# EAGLE board D-DAQ (EAGLE 6.4), part 1 of 2
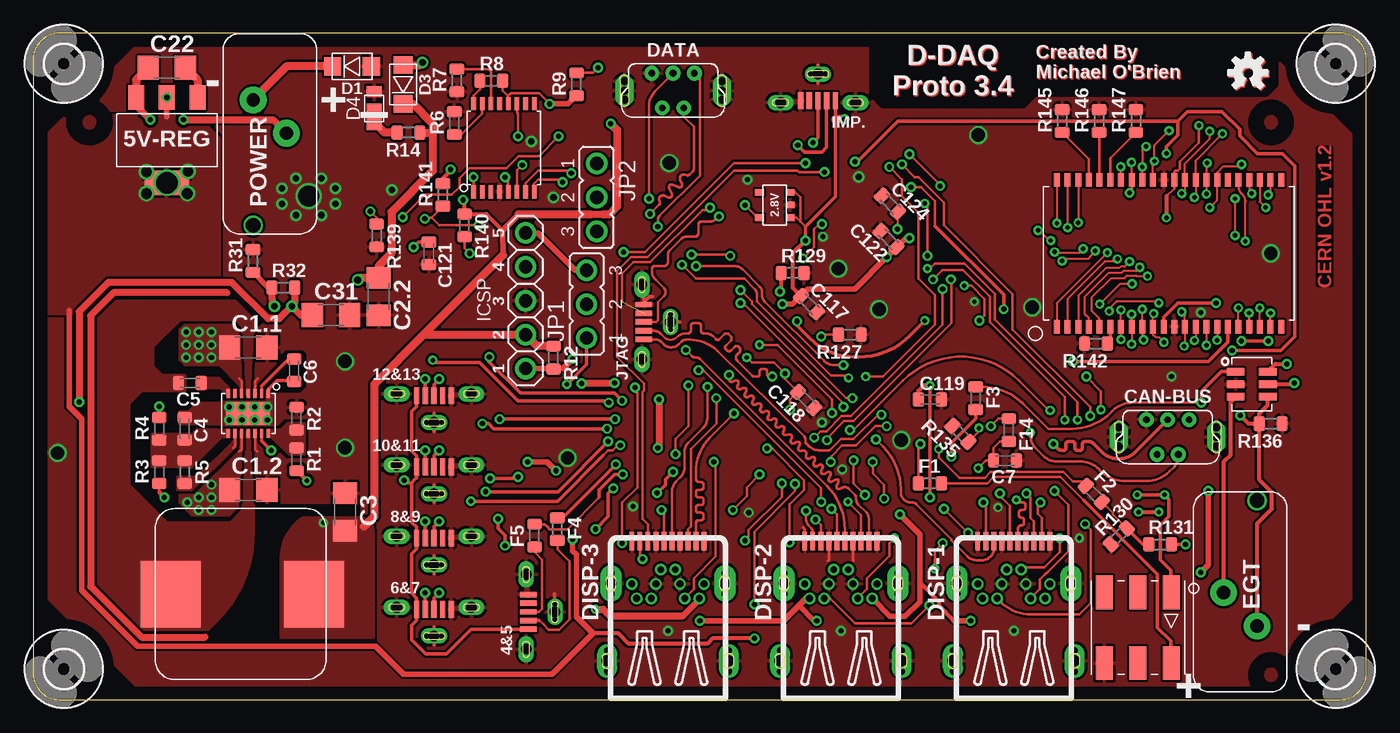
[diagram p1: board, top side]
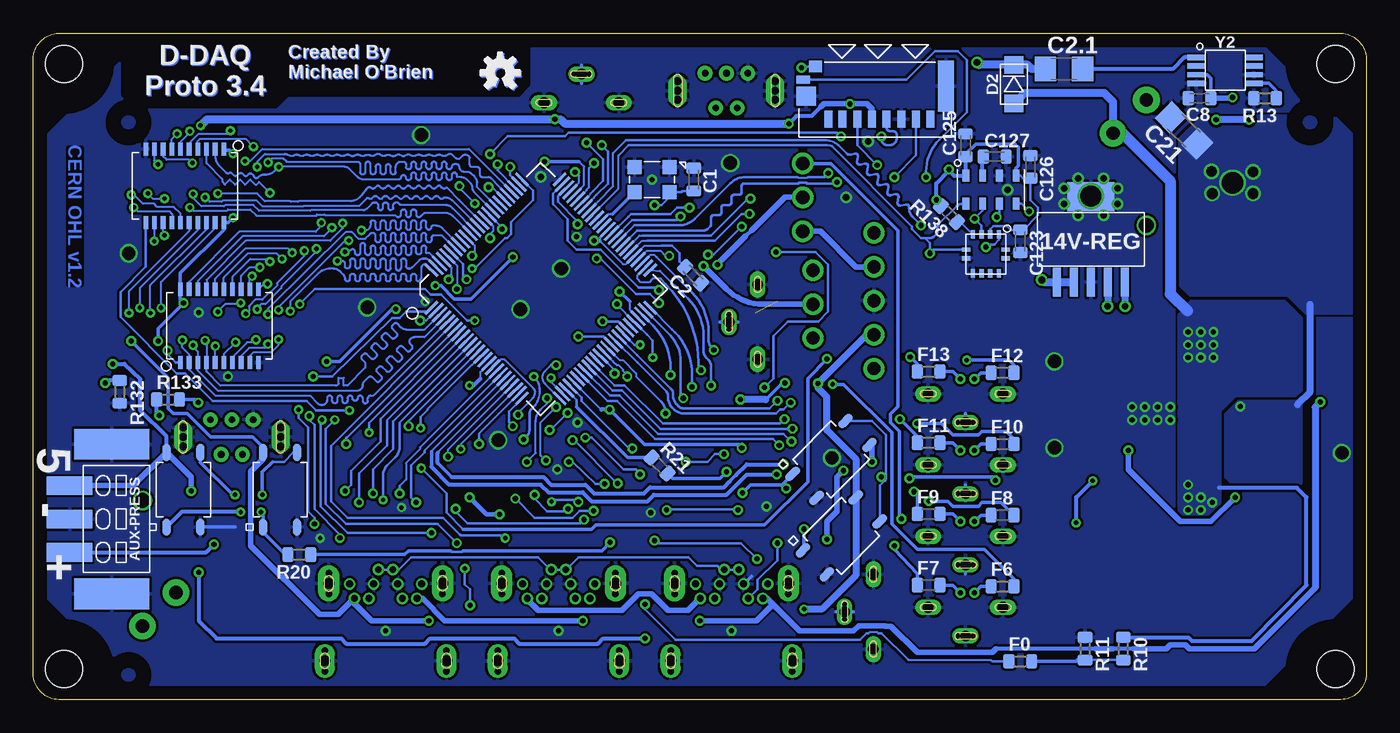
[diagram p2: board, bottom side, seen from below]

Size 99.82 x 49.91 mm. Coordinates in mm from the lower left corner, seen from the top.
Outline: 0,48.01 0,1.91 arc90 1.91,0 97.92,0 arc90 99.82,1.91 99.82,48.01 arc90 97.92,49.91 1.91,49.91 arc90 0,48.01
Copper layers (1*16): Top 0.0356mm / dielectric 1.5011mm / Bottom 0.0356mm
Design rules "LaenPCBOrder *": minimum track width 6mil, minimum drill 13mil, track to track 7mil, track to pad 7mil, pad to pad 7mil, via to via 7mil, smd to smd 0mil, copper to edge 40mil, drill to drill 6mil, minimum pad ring 7mil, minimum via ring 7mil, stop-mask expansion 3mil, vias tented up to drill 0mil, thermal gap 8mil
Net classes: 0 min: width 0.152 mm, drill 0.33 mm, clearance 0.152 mm; 1 default: width 0.178 mm, drill 0.381 mm, clearance 0.178 mm; 2 prefered: width 0.203 mm, drill 0.381 mm, clearance 0.203 mm; 3 power-low: width 0.406 mm, drill 0.381 mm, clearance 0.254 mm; 4 power-med: width 0.61 mm, drill 0.508 mm, clearance 0.381 mm; 5 power-hi: width 0.813 mm, drill 0.635 mm, clearance 0.508 mm
tRestrict: area 2.7,41.8 to 5.7,44.8; area 91.2,41.8 to 94.2,44.8; area 91.2,0.4 to 94.2,3.4; 7 lines
bRestrict: area 2.7,41.8 to 5.7,44.8; area 91.2,41.8 to 94.2,44.8; area 91.2,0.4 to 94.2,3.4; 6 lines

## Footprints (pad centres in the part's own frame; a part is rotated, then mirrored left to right if it is on the bottom)
SOT-23-5 = smd 0.5 x 0.65: 1 -0.95,-1.15; 2 0,-1.15; 3 0.95,-1.15; 4 0.95,1.15; 5 -0.95,1.15
SOP-4--CPC1017N = smd 0.6 x 1.3: 1 -1.27,-2.8; 2 1.27,-2.8; 3 1.27,2.8; 4 -1.27,2.8
USB-MICRO-B-VERT = smd 0.4 x 1.25: 1 -1.3,0.85; 2 -0.65,0.85; 3 0,0.85; 4 0.65,0.85; 5 1.3,0.85 | drill 0.381 pad 0.45: P$1 -0.601,-1.15; P$2 0.601,-1.15 | drill 0.8 pad 0.9 long: T0 0,-1.15 | drill 0.8 pad 0.7 long: T1 -2.8,1; T2 2.8,1
SOT-223-5 = smd 1.2 x 1.8: ADJ -2.3,-3.2; VIN 2.3,-3.2; VOUT 0,-3.2 | smd 3.3 x 1.8: VOUT-1 0,3.2
SOP-4--CPC1117N = smd 0.6 x 1.3: 1 -1.27,-2.8; 2 1.27,-2.8; 3 1.27,2.8; 4 -1.27,2.8
SOT-223-6 = smd 0.6 x 2.2: ADJ 2.54,-3.2; GND 0,-3.2; SHDN -2.54,-3.2; VIN -1.27,-3.2; VOUT 1.27,-3.2 | smd 3.5 x 2.2: TAB 0,3.2
TSOP-44 = smd 0.45 x 1: 1 -8.4,-5.5; 2 -7.6,-5.5; 3 -6.8,-5.5; 4 -6,-5.5; 5 -5.2,-5.5; 6 -4.4,-5.5; 7 -3.6,-5.5; 8 -2.8,-5.5; 9 -2,-5.5; 10 -1.2,-5.5; 11 -0.4,-5.5; 12 0.4,-5.5; 13 1.2,-5.5; 14 2,-5.5; 15 2.8,-5.5; 16 3.6,-5.5; 17 4.4,-5.5; 18 5.2,-5.5; 19 6,-5.5; 20 6.8,-5.5; 21 7.6,-5.5; 22 8.4,-5.5; 23 8.4,5.5; 24 7.6,5.5; 25 6.8,5.5; 26 6,5.5; 27 5.2,5.5; 28 4.4,5.5; 29 3.6,5.5; 30 2.8,5.5; 31 2,5.5; 32 1.2,5.5; 33 0.4,5.5; 34 -0.4,5.5; 35 -1.2,5.5; 36 -2,5.5; 37 -2.8,5.5; 38 -3.6,5.5; 39 -4.4,5.5; 40 -5.2,5.5; 41 -6,5.5; 42 -6.8,5.5; 43 -7.6,5.5; 44 -8.4,5.5
PC-1771101 = smd 1.4 x 3.4: P1 -2.5,-3; P2 0,-3; P3 2.5,-3 | smd 2.3 x 5.6: T0 -5.6,0.15; T1 5.6,0.15
C0603K = smd 0.85 x 1.1: 1 -0.85,0; 2 0.85,0
C1206 = smd 1.6 x 1.8: 1 -1.4,0; 2 1.4,0
USB-MINI-B-VERT = drill 0.5 pad 1.1: 1 1.6,1.3; 2 0.8,-1.3; 3 0,1.3; 4 -0.8,-1.3; 5 -1.6,1.3 | drill 0.6 pad 0.8: P$1 -3.65,0.7; P$2 -3.65,-0.7; P$3 3.65,0.7; P$4 3.65,-0.7 | drill 0.6 pad 1.4 long: T0 3.65,0; T1 -3.65,0
SOD-123W = smd 1.3 x 1.4: P$1 -1.45,0; P$2 1.45,0
TUMD2 = smd 0.8 x 1.1: P$1 -1.25,0 | smd 2 x 1.1: P$2 0.65,0
DP3AR020SU32JQ1-STANDARD = smd 0.35 x 1.4: 1 2.7,6.25; 3 2.1,6.25; 5 1.5,6.25; 7 0.9,6.25; 9 0.3,6.25; 11 -0.3,6.25; 13 -0.9,6.25; 15 -1.5,6.25; 17 -2.1,6.25; 19 -2.7,6.25 | drill 0.5 pad 0.85: 2 2.7,3.042; 8 0.9,3.042; 14 -0.9,3.042 | drill 0.5 pad 0.8: 4 2.35,1.955; 6 1.25,1.955; 10 0.55,4.11; 12 -0.55,4.11; 16 -1.25,1.955; 18 -2.35,1.955; 20 -2.7,3.042 | drill 0.8 pad 1.6 long: BL 4.26,3.09; BR -4.26,3.09 | drill 0.8 pad 1.5 long: FL 4.56,-2.72; FR -4.56,-2.72 | drill 0.5 pad 0.7: P$1 -4.25,3.85; P$2 -4.25,2.3; P$3 4.25,3.85; P$4 4.25,2.3; P$5 -4.55,-1.95; P$6 -4.55,-3.5; P$7 4.55,-1.95; P$8 4.55,-3.5
PC-1702610 = drill 1 pad 2: L 1.25,1.25; R -1.25,-1.25 | drill 1.1 pad 1.4: L1 8.15,-1.25
SOT-8 = smd 0.56 x 1.33: 1 -0.95,-1.2; 2 0,-1.2; 3 0.95,-1.2; 4 0.95,1.2; 5 0,1.2; 6 -0.95,1.2
R0603 = smd 0.85 x 1.1: 1 -0.85,0; 2 0.85,0
1X05 = drill 1 pad 1.6: 1 -5.08,0; 2 -2.54,0; 3 0,0; 4 2.54,0; 5 5.08,0
JP2 = drill 1 pad 1.6: 1 -2.54,0; 2 0,0; 3 2.54,0
7443551XXX = smd 4.5 x 5: P$1 -5.25,0; P$2 5.5,0
TSSOP-20 = smd 0.35 x 1: 1 -2.925,-2.75; 2 -2.275,-2.75; 3 -1.625,-2.75; 4 -0.975,-2.75; 5 -0.325,-2.75; 6 0.325,-2.75; 7 0.975,-2.75; 8 1.625,-2.75; 9 2.275,-2.75; 10 2.925,-2.75; 11 2.925,2.75; 12 2.275,2.75; 13 1.625,2.75; 14 0.975,2.75; 15 0.325,2.75; 16 -0.325,2.75; 17 -0.975,2.75; 18 -1.625,2.75; 19 -2.275,2.75; 20 -2.925,2.75
QFN-14 = smd 0.7 x 0.25: 1 -1.5,1.5; 2 -1.5,1; 3 -1.5,0.5; 4 -1.5,0; 5 -1.5,-0.5; 6 -1.5,-1; 7 -1.5,-1.5; 8 1.5,-1.5; 9 1.5,-1; 10 1.5,-0.5; 11 1.5,0; 12 1.5,0.5; 13 1.5,1; P14 1.5,1.5 | smd 1.7 x 3.3: P$15 0,0
SCHA4B0400 = smd 0.6 x 1.25: 1 3.5,1.575; 2 2.45,1.575; 3 1.35,1.575; 4 0.25,1.575; 5 -0.85,1.575; 6 -1.95,1.575; 7 -3.05,1.575; 8 -4.15,1.575 | smd 1.2 x 3.8: G1 -5.3,-0.905 | smd 1.45 x 1.4: G2 5.175,-0.15 | smd 1 x 0.6: G3 5.4,-1.4 | smd 0.95 x 0.85: G4 4.475,-2.375
QFN-12 = smd 0.635 x 0.325: 1 -1.462,0.975; 2 -1.462,0.325; 3 -1.462,-0.325; 4 -1.462,-0.975; 7 1.462,-0.975; 8 1.462,-0.325; 9 1.462,0.325; 10 1.462,0.975 | smd 0.325 x 0.635: 5 -0.325,-1.462; 6 0.325,-1.462; 11 0.325,1.462; 12 -0.325,1.462
LGA-8 = smd 0.9 x 0.5: 1 1.05,1.875; 2 1.05,0.625; 3 1.05,-0.625; 4 1.05,-1.875; 5 -1.05,-1.875; 6 -1.05,-0.625; 7 -1.05,0.625; 8 -1.05,1.875
LEADLESS-SMT = smd 2.54 x 1.27: 1 -2.65,2.5; 2 -2.65,0; 3 -2.65,-2.5; 4 2.65,-2.5; 5 2.65,0; 6 2.65,2.5
TQFP-100 = smd 1.3 x 0.2: 1 -6.8,4.8; 25 -6.8,-4.8; 51 6.8,-4.8; 75 6.8,4.8 | smd 1.5 x 0.2: 2 -6.7,4.4; 3 -6.7,4; 4 -6.7,3.6; 5 -6.7,3.2; 6 -6.7,2.8; 7 -6.7,2.4; 8 -6.7,2; 9 -6.7,1.6; 10 -6.7,1.2; 11 -6.7,0.8; 12 -6.7,0.4; 13 -6.7,0; 14 -6.7,-0.4; 15 -6.7,-0.8; 16 -6.7,-1.2; 17 -6.7,-1.6; 18 -6.7,-2; 19 -6.7,-2.4; 20 -6.7,-2.8; 21 -6.7,-3.2; 22 -6.7,-3.6; 23 -6.7,-4; 24 -6.7,-4.4; 52 6.7,-4.4; 53 6.7,-4; 54 6.7,-3.6; 55 6.7,-3.2; 56 6.7,-2.8; 57 6.7,-2.4; 58 6.7,-2; 59 6.7,-1.6; 60 6.7,-1.2; 61 6.7,-0.8; 62 6.7,-0.4; 63 6.7,0; 64 6.7,0.4; 65 6.7,0.8; 66 6.7,1.2; 67 6.7,1.6; 68 6.7,2; 69 6.7,2.4; 70 6.7,2.8; 71 6.7,3.2; 72 6.7,3.6; 73 6.7,4; 74 6.7,4.4 | smd 0.2 x 1.3: 26 -4.8,-6.8; 50 4.8,-6.8; 76 4.8,6.8; 100 -4.8,6.8 | smd 0.2 x 1.5: 27 -4.4,-6.7; 28 -4,-6.7; 29 -3.6,-6.7; 30 -3.2,-6.7; 31 -2.8,-6.7; 32 -2.4,-6.7; 33 -2,-6.7; 34 -1.6,-6.7; 35 -1.2,-6.7; 36 -0.8,-6.7; 37 -0.4,-6.7; 38 0,-6.7; 39 0.4,-6.7; 40 0.8,-6.7; 41 1.2,-6.7; 42 1.6,-6.7; 43 2,-6.7; 44 2.4,-6.7; 45 2.8,-6.7; 46 3.2,-6.7; 47 3.6,-6.7; 48 4,-6.7; 49 4.4,-6.7; 77 4.4,6.7; 78 4,6.7; 79 3.6,6.7; 80 3.2,6.7; 81 2.8,6.7; 82 2.4,6.7; 83 2,6.7; 84 1.6,6.7; 85 1.2,6.7; 86 0.8,6.7; 87 0.4,6.7; 88 0,6.7; 89 -0.4,6.7; 90 -0.8,6.7; 91 -1.2,6.7; 92 -1.6,6.7; 93 -2,6.7; 94 -2.4,6.7; 95 -2.8,6.7; 96 -3.2,6.7; 97 -3.6,6.7; 98 -4,6.7; 99 -4.4,6.7
TSSOP-16 = smd 0.35 x 1: 1 -2.275,-3.3; 2 -1.625,-3.3; 3 -0.975,-3.3; 4 -0.325,-3.3; 5 0.325,-3.3; 6 0.975,-3.3; 7 1.625,-3.3; 8 2.275,-3.3; 9 2.275,3.3; 10 1.625,3.3; 11 0.975,3.3; 12 0.325,3.3; 13 -0.325,3.3; 14 -0.975,3.3; 15 -1.625,3.3; 16 -2.275,3.3
2,8 = hole 2.8: 0,0
XTC7009 = smd 1.05 x 1.05: P$1 -1.3,-0.925; P$2 1.3,-0.925; P$3 1.3,0.925; P$4 -1.3,0.925
SOIC-8 = smd 1.35 x 0.4: 1 -2.15,0.975; 2 -2.15,0.325; 3 -2.15,-0.325; 4 -2.15,-0.975; 5 2.15,-0.975; 6 2.15,-0.325; 7 2.15,0.325; 8 2.15,0.975

## Placement (x,y rotation side)
2.8V  TC1016  [SOT-23-5]  55.53,37.05 90 top
3.3V-TOGGLE-1  NO SSR  [SOP-4--CPC1017N]  39.31,12.26 315 bottom
3.3V-TOGGLE-2  NO SSR  [SOP-4--CPC1017N]  81.34,15.72 0 bottom
4&5  Micro USB  [USB-MICRO-B-VERT]  37.91,6.57 90 top
5V-REG  ZLDO1117-5.0  [SOT-223-5]  10,41.91 180 top
5V-TOGGLE-1  NC SSR  [SOP-4--CPC1117N]  40.07,17.99 315 bottom
5V-TOGGLE-2  NC SSR  [SOP-4--CPC1117N]  88.58,15.72 0 bottom
6&7  Micro USB  [USB-MICRO-B-VERT]  30,5.91 0 top
8&9  Micro USB  [USB-MICRO-B-VERT]  30,11.24 0 top
10&11  Micro USB  [USB-MICRO-B-VERT]  30,16.57 0 top
12&13  Micro USB  [USB-MICRO-B-VERT]  30,21.91 0 top
14V-REG  TL1963A-33DCQ  [SOT-223-6]  20.62,34.48 0 bottom
AS7C31026B  1 Mbit SRAM  [TSOP-44]  85.06,33.43 0 top
AUX-PRESS  PC-1771101  [PC-1771101]  94.11,13.53 270 bottom
C1  10nF  [C0603K]  50.36,38.96 270 bottom
C1.1  47uF  [C1206]  16.1,26.38 0 top
C1.2  47uF  [C1206]  16.1,15.72 0 top
C2  10uF  [C0603K]  50.42,31.79 135 bottom
C2.1  4.7uF  [C1206]  22.62,47.24 0 bottom
C2.2  4.7uF  [C1206]  25.86,30.19 270 top
C3  47uF  [C1206]  23.34,14.05 270 top
C4  1uF  [C0603K]  11.33,20.29 270 top
C5  0.1uF  [C0603K]  11.72,23.72 180 top
C6  10nF  [C0603K]  19.53,24.67 270 top
C7  0.1uF  [C0603K]  72.77,17.91 180 top
C8  0.1uF  [C0603K]  12.48,45.05 180 bottom
C21  47uF  [C1206]  13.64,42.62 135 bottom
C22  4.7uF  [C1206]  10,47.34 0 top
C31  10uF  [C1206]  22.29,28.79 0 top
C117  0.1uF  [C0603K]  58.1,29.62 315 top
C118  0.1uF  [C0603K]  57.87,22.44 135 top
C119  0.1uF  [C0603K]  67.15,22.48 0 top
C121  0.1uF  [C0603K]  29.62,33.43 270 top
C122  0.1uF  [C0603K]  64.05,34.49 135 top
C123  4.7uF  [C0603K]  25.91,34.34 270 bottom
C124  10uF  [C0603K]  64.17,37.15 315 top
C125  10uF  [C0603K]  30,41.53 90 bottom
C126  0.1uF  [C0603K]  25.15,39.91 270 bottom
C127  0.1uF  [C0603K]  27.81,40.67 0 bottom
CAN-BUS  Mini USB  [USB-MINI-B-VERT]  84.96,19.67 0 top
D1  S07D  [SOD-123W]  23.86,47.43 0 top
D2  PMEG2010ER  [SOD-123W]  26.38,46.1 270 bottom
D3  PMEG2010ER  [SOD-123W]  27.69,46.08 90 top
D4  TFZ20B  [TUMD2]  25.53,44.29 270 top
DATA  Mini USB  [USB-MINI-B-VERT]  47.91,45.62 0 top
DISP-1  DP3AR020SU32JQ1-STANDARD  [DP3AR020SU32JQ1-STANDARD]  73.44,5.62 0 top
DISP-2  DP3AR020SU32JQ1-STANDARD  [DP3AR020SU32JQ1-STANDARD]  60.48,5.62 0 top
DISP-3  DP3AR020SU32JQ1-STANDARD  [DP3AR020SU32JQ1-STANDARD]  47.53,5.62 0 top
EGT  1702610  [PC-1702610]  90.39,6.76 90 top
EGT-AMP  MAX4239  [SOT-8]  91.25,23.62 270 top
F0  470  [R0603]  25.91,2.86 0 bottom
F1  470  [R0603]  67.15,16.19 0 top
F2  470  [R0603]  79.42,15.42 315 top
F3  470  [R0603]  70.58,22.57 270 top
F4  470  [R0603]  39.24,12.76 270 top
F5  470  [R0603]  37.53,12.29 90 top
F6  470  [R0603]  27.24,8.48 0 bottom
F7  470  [R0603]  32.77,8.57 0 bottom
F8  470  [R0603]  27.24,13.81 0 bottom
F9  470  [R0603]  32.77,13.91 0 bottom
F10  470  [R0603]  27.24,19.15 0 bottom
F11  470  [R0603]  32.77,19.24 0 bottom
F12  470  [R0603]  27.24,24.48 0 bottom
F13  470  [R0603]  32.77,24.57 0 bottom
F14  470  [R0603]  73.06,20.19 270 top
ICSP  ICSP Header  [1X05]  36.86,29.88 270 top
IMP.  Micro USB  [USB-MICRO-B-VERT]  58.77,45.72 180 top
JP1  AN6-Clk  [JP2]  41.43,29.62 90 top
JP2  AN7-Data  [JP2]  42.2,37.62 270 top
JTAG  Micro USB  [USB-MICRO-B-VERT]  46.58,28.29 90 top
L1  7.6uH  [7443551XXX]  15.53,7.91 0 top
LATCH-HIGH  Octal D-Latch  [TSSOP-20]  88.47,38.49 180 bottom
LATCH-LOW  Octal D-Latch  [TSSOP-20]  85.88,28 0 bottom
MAIN-SMPS  MP2209  [QFN-14]  16.1,21.43 270 top
MICRO-SD  SCHA4B0400  [SCHA4B0400]  36.77,45.05 180 bottom
MMA8652FC  Accelerometer  [QFN-12]  28.48,33.39 270 bottom
MPL3115A101  Baro & Temp  [LGA-8]  28.1,38.2 90 bottom
NBPLANN100PAUNV  Boost  [LEADLESS-SMT]  82.72,5.38 270 top
PIC32MX  795F512L-80V/PT  [TQFP-100]  61.82,30.77 45 bottom
POWER  1702610  [PC-1702610]  17.71,43.68 270 top
R1  499k  [R0603]  19.72,18 270 top
R2  158k  [R0603]  19.72,21.05 270 top
R3  100k  [R0603]  9.43,17.05 90 top
R4  10  [R0603]  9.43,20.29 90 top
R5  100k  [R0603]  11.33,17.05 270 top
R6  10k  [R0603]  31.53,43.2 90 top
R7  10k  [R0603]  31.72,46.39 90 top
R8  10k  [R0603]  34.29,46.35 0 top
R9  10k  [R0603]  40.67,46.1 90 top
R10  10k  [R0603]  18.19,3.81 270 bottom
R11  1.4k  [R0603]  21.05,3.81 270 bottom
R12  10k  [R0603]  38.96,25.62 270 top
R13  10k  [R0603]  7.57,45.05 180 bottom
R14  34  [R0603]  28.1,42.48 180 top
R20  100  [R0603]  79.91,10.86 180 bottom
R21  100  [R0603]  52.91,17.53 315 bottom
R31  3.01k  [R0603]  16.44,32.86 90 top
R32  30.9k  [R0603]  18.72,30.86 0 top
R127  10k  [R0603]  61.15,27.34 180 top
R129  10k  [R0603]  56.86,31.96 0 top
R130  10k  [R0603]  81.3,12.24 45 top
R131  255  [R0603]  84.39,11.62 0 top
R132  10k  [R0603]  93.34,23.05 270 bottom
R133  100k  [R0603]  89.73,22.48 0 bottom
R135  10k  [R0603]  69.44,19.91 135 top
R136  1.4k  [R0603]  92.68,20.67 180 top
R138  10k  [R0603]  31.24,36.39 135 bottom
R139  10k  [R0603]  25.72,34.77 270 top
R140  1.4k  [R0603]  32.29,35.53 270 top
R141  1.4k  [R0603]  30.67,37.81 90 top
R142  10k  [R0603]  79.58,26.67 180 top
R145  10k  [R0603]  77.06,43.34 90 top
R146  10k  [R0603]  79.82,43.34 90 top
R147  10k  [R0603]  82.58,43.34 90 top
SC18IS602B  I2C to SPI  [TSSOP-16]  35.24,41.34 0 top
U$2  [2,8]  2.29,2.29 0 top
U$3  [2,8]  2.29,47.62 90 top
U$4  [2,8]  97.54,47.62 0 top
U$5  [2,8]  97.54,2.29 90 top
U$6  [OSHW-LOGO-S]  91.06,46.86 0 top
U$7  [OSHW-LOGO-S]  64.77,46.86 0 bottom
Y1  16.368 MHz  [XTC7009]  53.48,38.96 180 bottom
Y2  DS1099  [SOIC-8]  10.56,47.14 0 bottom

## Tracks (layer width: path | path; a pad name or v marks a point on that pad's centre or on a via)
3.3-&-5V-TOGGLE1
  Bottom 0.152: PIC32MX.28 59.15,22.44
  Bottom 0.203: 59.15,22.44 59.15,21.91
  Bottom 0.254: 59.15,21.91 55.34,18.19 55.27,18.13 R21.1
3.3-&-5V-TOGGLE2  (via drill 0.38)
  Top 0.203: v54.96,18.81 55.34,18.81 57.72,16.43 57.72,15.72 56.63,14.62 v56.63,11.76
  Bottom 0.152: PIC32MX.29 58.77,22.63
  Bottom 0.203: 58.77,22.63 58.77,22.38 55.2,18.81 v54.96,18.81 | 67.63,11.14 67.72,11.05 68.48,11.05 68.58,11.14
  Bottom 0.254: v56.63,11.76 57.24,11.14 67.63,11.14 | 68.58,11.14 71.72,11.14 72.01,10.86 R20.1
3.3V-RAIL  (via drill 0.33, 0.38)
  Top 0.152: AS7C31026B.11 84.68,27.91
  Top 0.203: v53.44,25.62 53.82,25.24 55.48,25.24 v56.29,24.43 56.29,24.02 C118.2 56.67,22.48 v56.67,21.72 | v69.72,31 70.25,31 71.25,30 71.25,28.77 v70.87,28.38 | v87.3,43.01 87.3,41.72 85.87,40.29 85.87,39.77 85.72,39.62 85.53,39.62 85.44,39.53 85.44,38.95 | 84.87,37.72 85.44,38.29 85.44,38.95 | AS7C31026B.33 85.44,38.95 | 2.8V.1 57.15,36.1 57.44,35.81 | 57.44,35.81 57.82,35.43 | 2.8V.3 57.06,38 57.44,37.62 57.44,35.81 | R8.2 35.14,45.63 35.57,45.2 SC18IS602B.12 35.57,45.23 35.77,45.43 37.86,45.43 v38.67,44.62
  Top 0.254: AS7C31026B.11 84.66,28.67 85.71,29.72 v88.58,29.72 | v67.15,23.53 v67.15,15.14 | v57.82,34.38 57.82,35.43 60.07,37.69 60.07,43.48 IMP..1 | v92.49,26.86 v90.49,26.86 | 46.86,18.95 v46.77,18.86
  Top 0.305: 84.87,37.72 v84.87,36.1 | 66.39,8.76 67.82,7.33 67.82,7.05 68.96,5.91 | R141.2 30.67,39.05 31.24,39.62 | v32.19,37.43 32.29,37.34 R140.1 33.92,36.38 35.15,35.15 | v57.82,34.38 56.86,33.43 56.86,30.86 C117.1 | v67.15,23.53 66.67,23.53 66.28,23.13 C119.1 | v20.48,16.38 v20.49,16.38 R1.2
  Top 0.406: v64.91,13.86 66.39,12.38 66.39,8.76 66.39,7.33 65.29,6.24 64.16,6.24 DISP-2.4 | v70.2,5.91 68.96,5.91 | v38.67,44.62 40.06,44.62 R9.1 | 31.24,39.62 v31.24,39.72 | 35.2,33.29 35.15,35.15 36.34,36.34 | v65.63,34.58 65.37,34.58 C122.1 v63.91,33.15 61.53,30.77 58.01,30.77 C117.1 56.87,29.62 v56.1,29.62 | DISP-3.4 49.88,7.49 48.67,6.29 | v43.53,23.72 43.48,23.67
  Top 0.508: v42.1,6.76 42.67,6.76 43.15,6.29 48.67,6.29 | 42.67,36.34 41.72,36.34 | v46.86,22.48 46.86,18.95 | 43.48,23.67 v41.05,23.67
  Top 0.61: 35.2,33.29 29.24,27.34 | v43.24,43.15 43.72,42.67 43.72,36.96 43.1,36.34 42.67,36.34 | 41.72,36.34 36.34,36.34 | v60.77,43.48 60.07,43.48 | 29.24,27.34 ICSP.4 37.73,26.47 R12.1 | 29.24,27.34 25.53,23.62 25.53,13.72 24.77,12.95
  Bottom 0.152: 57.29,21.72 PIC32MX.30 | 65.39,35.47 65.39,35.1 65.63,34.86 | 52.77,34 54.05,34 PIC32MX.55 55.43,32.62 55.67,32.62 57.39,34.34 57.39,34.63 PIC32MX.62 | 56.29,24.68 PIC32MX.37 | 53.86,27.34 54.24,27.72 PIC32MX.46 56.1,29.58 v56.1,29.62 | PIC32MX.2 70.42,28.38 | 66.34,24.05 66.34,24.54 PIC32MX.16
  Bottom 0.203: PIC32MX.86 65.39,35.47 | 65.63,34.86 v65.63,34.58 | 52.77,34 52.01,34 51.44,33.43 51.44,32.8 C2.2 | v56.29,24.43 56.29,24.68 | v53.44,25.62 53.44,26.91 53.86,27.34 | 70.42,28.38 v70.87,28.38 | MMA8652FC.2 28.16,35.23 27.91,35.48 26.91,35.48 26.61,35.19 C123.1 25.68,35.19 24.57,36.29 24.57,36.86 25.15,37.43 C126.2 25.73,39.06 25.91,39.24 MPL3115A101.4 | R138.2 31.84,37.08 v32.19,37.43
  Bottom 0.254: v84.87,36.1 85.23,35.74 LATCH-HIGH.20 85.55,35.23 88.81,31.97 LATCH-LOW.20 88.81,29.94 v88.58,29.72 90.49,27.81 v90.49,26.86 | v56.67,21.72 54.05,19.1 47.01,19.1 v46.77,18.86 | 57.39,34.34 57.77,34.34 v57.82,34.38 | v69.72,31 69.29,31 68.29,30 67.06,30 v63.91,33.15 | v92.49,26.86 89.72,24.1 89.72,21.81 89.34,21.43 88.3,21.43 86.53,19.67 83.39,19.67 82.61,18.89 3.3V-TOGGLE-2.4 | v43.53,23.72 43.72,23.72 44.96,22.48 | MPL3115A101.4 26.22,39.83 26.05,40.01 26.05,41.39 26.29,41.62 29.24,41.62 30,40.86 C125.1
  Bottom 0.305: v56.67,21.72 57.29,21.72 | 66.34,24.05 66.86,23.53 v67.15,23.53 | v32.19,37.43 32.19,38.67 31.24,39.62 30.86,39.24 MPL3115A101.1 29.97,40.62 C125.1 | 40.81,44.43 41.53,43.72 42.67,43.72 v43.24,43.15 | v21.72,13.24 21.72,15.14 v20.48,16.38
  Bottom 0.356: v67.15,15.14 65.86,13.86 v64.91,13.86
  Bottom 0.406: v70.2,5.91 74.49,5.91 75.79,7.21 DISP-1.4 76.98,6.38 78.4,6.38 83.53,11.52 83.53,17.1 82.61,18.02 3.3V-TOGGLE-2.4 | DISP-2.4 62.78,7.44 62.01,6.67 55.72,6.67 54.48,7.91 53.53,7.91 52.29,6.67 50.79,6.67 DISP-3.4 | MICRO-SD.4 37.02,44.26 37.39,44.62 v38.67,44.62 40.62,44.62 40.81,44.43 | 31.24,39.62 v31.24,39.72
  Bottom 0.508: v42.1,6.76 40.77,6.76 38.23,9.3 3.3V-TOGGLE-1.4 38.23,18.04 40.39,20.19 40.39,22.67 41.05,23.34 v41.05,23.67 37.39,27.34 ICSP.4 | 44.96,22.48 v46.86,22.48
  Bottom 0.61: v87.3,43.01 86.82,43.48 60.34,43.48 60.01,43.15 v43.24,43.15
  pour Top (isolate 0.203, no thermals): 20.47,13.62 24.38,13.62 arc-90 25.43,12.57 25.43,4.67 18.57,4.67 18.57,10.59 arc-45 19.64,13.16 19.83,13.36 arc-45
5V-ADJ
  Top 0.61: C22.2 12.3,46.44 5V-REG.ADJ
5V-RAIL  (via drill 0.38, 0.8, 1.6)
  Top 0.305: EGT-AMP.6 93.02,25.15 v93.87,25.15 | v54.01,4.57 50.86,4.57 50.48,4.19 44.58,4.19 43.81,4.95 41.91,4.95 | R4.2 v9.43,21.95
  Top 0.406: v88.01,15.62 88.01,10.1 v87.44,9.53 | v37.01,17.81 38.48,17.81 v39.15,17.14 | v40.39,12 40.39,11.14 40.67,10.86 40.67,6.19 41.91,4.95 38.86,1.91 27.72,1.91 25.62,4 7.81,4 3.62,8.19 3.62,21 2.67,21.95 2.67,29.15 | 5V-REG.VOUT 10,43.67
  Bottom 0.254: Y2.3 11.9,46.81 11.63,46.54 C8.1
  Bottom 0.305: 5V-TOGGLE-2.4 89.85,19.7 91.82,21.67 91.82,24 93.01,25.15 v93.87,25.15 | v87.44,9.53 87.44,5.91 86.11,4.57 76.77,4.57 76.39,4.19 70.48,4.19 70.1,4.57 63.82,4.57 63.44,4.19 57.53,4.19 57.15,4.57 v54.01,4.57
  Bottom 0.406: AUX-PRESS.P1 92.34,16.03 5V-TOGGLE-2.4 88.01,16.68 v88.01,15.62 | v39.15,17.14 39.62,16.67 39.62,14.1 40.39,13.34 v40.39,12 | 5V-TOGGLE-1.3 37.01,18.88 v37.01,17.81 | C8.1 10.06,45.05 5V-REG.VOUT
  Bottom 0.508: 4.19,29.62 4.19,23.05 5.14,22.1
  other vias: 10,45.11 8.48,39.53 8.48,37.91 10,38.72 11.53,37.91 11.57,39.58
  pour Top (isolate 0.203, rank 4): 13.91,42.01 12.19,43.72 2.48,43.72 1.14,42.39 1.14,28.96 3.62,28.96 5.81,31.15 13.91,31.15
  pour Bottom (isolate 0.203, rank 5, no thermals): 12.19,43.72 2.48,43.72 1.14,42.39 1.14,28.96 4.52,28.96 5.86,30.29 13.14,30.29 13.91,31.05 13.91,42.01
  pour Bottom (isolate 0.203, rank 2): 9.81,15.91 10.57,16.67 10.57,21.62 9.81,22.38 4.86,22.38 4.86,15.91
12V-BS
  pour Top (isolate 0.254, rank 5, no thermals): 12.48,23.34 14,23.34 14.67,22.67 14.67,23.34 13.91,24.1 12.48,24.1
12V-ENABLE  (via drill 0.38)
  Top 0.203: R3.1 9.43,15.53 | MAIN-SMPS.13 17.1,19.38
  Top 0.254: 17.1,19.38 v17.81,18.67
  Top 0.305: 9.43,15.53 v9.81,15.14
  Bottom 0.406: v17.81,18.67 17.81,17.24 13.91,13.34 11.62,13.34 v9.81,15.14
12V-FB
  pour Top (isolate 0.203, rank 2, no thermals): 17.62,20.19 18.57,20.19 19.05,20.67 20.29,20.67 20.29,18.38 19.15,18.38 17.81,19.72 17.62,19.72
12V-INPUT  (via drill 0.38)
  Top 0.203: MAIN-SMPS.5 15.6,23.88 15.43,24.05 | MAIN-SMPS.10 15.6,18.74 15.43,18.57
  Top 0.508: 5V-REG.VIN 7.7,44.5 v8.76,43.43 | v11.24,43.43 17.96,43.43 POWER.L
  Top 0.61: C22.1 7.7,46.44 5V-REG.VIN
  Bottom 0.305: R10.1 13.33,4.66 13.05,4.38 8.57,4.38 4.48,8.57 4.48,15.14 5.19,15.86 11,15.86
  Bottom 0.508: v8.76,43.43 v11.24,43.43
  Bottom 0.61: D2.P$2 25.6,45.43 19.62,45.43 18.96,44.77 POWER.L
  Bottom 0.813: POWER.L 18.24,42.43 14.67,38.86 14.67,30.39 13.37,29.11
  other vias: 13.34,16.1 13.34,27.53 12.38,27.53 12.38,26.57 13.34,25.62 13.34,26.57 12.38,25.62 11.43,27.53 11.43,26.57 11.43,25.62 12.38,14.19 13.34,15.14 12.38,15.14 13.34,14.19 11.53,14.76
  pour Bottom (isolate 0.203): 14,13.62 11.53,13.62 10.95,14.19 10.95,21.62 9.81,22.76 4.86,22.76 4.86,28.57 6.1,29.81 13.14,29.81 14,28.86
  pour Top (isolate 0.203, rank 4, no thermals): 15.48,18.72 12.1,15.34 10.95,15.34 10.95,14.71 11.86,13.81 14.76,13.81 15.72,14.76 15.72,20.1 15.48,20.1
  pour Top (isolate 0.203, rank 3, no thermals): 15.71,27.34 15.71,22.76 15.49,22.76 15.49,23.47 13.9,25.05 11.33,25.05 10.95,25.43 10.95,27.72 11.33,28.1 14.95,28.1
12V-OK
  Top 0.203: MAIN-SMPS.9 15.1,19 14.95,18.86
  pour Top (isolate 0.203, rank 5, no thermals): 10.76,15.72 12.1,15.72 15.24,18.86 15.24,20.1 14.95,20.1 14.95,19.34 12.29,16.67 10.76,16.67
12V-SS
  Top 0.203: 17.1,23.49 MAIN-SMPS.2
  Top 0.254: C6.1 19.13,25.52 17.1,23.49
12V-SW
  Top 0.254: C5.2 11.14,23.72
  pour Top (isolate 0.203, rank 2, no thermals): 16.19,20.1 16,20.1 15.91,16.57 15.72,16.38 15.72,14.19 14.76,13.24 10,13.24 7.14,16.1 7.14,22.19 8.1,23.15 11.33,23.15 11.33,24.29 9.62,24.29 8.95,24.96 8.95,26.45 10.99,28.48 15.14,28.48 15.72,27.91 15.72,26 15.91,25.81 16,22.76 16.19,22.76 16.29,25.81 16.48,26 16.48,28.48 15.14,29.81 6.1,29.81 4.86,28.57 4.86,8.67 8.29,5.24 13.07,5.24 13.69,5.86 arc45 16.48,12.59 16.48,16.38 16.29,16.57
12V-VCC
  pour Top (isolate 0.203, rank 2, no thermals): 14.14,19.67 14.67,19.67 14.67,20.24 12.24,20.24 11.91,19.91 8.86,19.91 8.86,17.43 11.91,17.43
14V-12V-DIVIDER
  Bottom 0.203: R11.2 R10.2
  Bottom 0.254: R11.2 21.63,2.96 21.72,2.86 F0.2
14V-ADJ  (via drill 0.5)
  Top 0.406: R31.1 17.59,30.86 R32.1
  Top 0.508: R32.1 17.87,30.03 17.87,29.65 v18.05,29.46
  Bottom 0.508: 14V-REG.ADJ 18.08,29.5 v18.05,29.46
14V-INPUT  (via drill 0.5)
  Top 0.61: v24.29,31.43 24.45,31.59 C2.2.1 25.86,32.48 26.81,33.43 26.81,36.53 29.91,39.62 29.91,42.48 | 29.91,42.48 29.91,43.15 28.42,44.63 D3.P$1 | R14.1 29.91,42.48
  Bottom 0.61: v24.29,31.43 24.14,31.28 14V-REG.SHDN 14V-REG.VIN
14V-RAIL  (via drill 0.38, 0.5)
  Top 0.406: v49.91,5.91 56.2,5.91 57.34,7.05 | v58.67,5.91 58.48,5.91 57.34,7.05 | 57.34,7.05 57.87,7.57 DISP-2.18
  Top 0.508: v3.43,22.29 3.43,29.05 5.62,31.24 14.86,31.24 17.57,28.53 18.41,28.53 v19.35,29.46 | R32.2 19.57,29.68 v19.35,29.46 | C31.1 20.02,28.79 v19.35,29.46
  Bottom 0.305: 17.43,3.81 18.95,3.81 | 20.29,3.81 27.72,3.81
  Bottom 0.406: v49.91,5.91 45.67,5.91 44.43,7.14 | v58.67,5.91 69.01,5.91 70.68,7.57 DISP-1.18 | 3.81,8.38 8.38,3.81 13.24,3.81 13.53,4.1 14.67,4.1 14.95,3.81 17.43,3.81 | 18.95,3.81 20.29,3.81 | 27.72,3.81 28,3.52 33.62,3.52 35.58,5.48 36.01,5.48 36.05,5.52 38.01,5.52 38.39,5.14 42.43,5.14 44.43,7.14 | 44.43,7.14 44.87,7.57 DISP-3.18
  Bottom 0.508: v3.43,22.29 3.81,21.91 3.81,8.38 | 14V-REG.VOUT v19.35,29.46
100-PSI-SENSOR-RES  (via drill 0.33)
  Top 0.305: v82.77,14.05 v84.3,14.05
  Bottom 0.254: R20.2 80.96,10.86 81.15,11.05 82.61,12.52 3.3V-TOGGLE-2.1 82.61,13.89 v82.77,14.05
  Bottom 0.305: v84.3,14.05 88.72,14.05 5V-TOGGLE-2.1
A0-PD
  Top 0.203: R7.2 34.11,47.24 34.27,47.08 SC18IS602B.14
A1-PD
  Top 0.203: SC18IS602B.15 33.62,43.9 32.06,42.35 R6.1
A2-PU
  Top 0.203: SC18IS602B.16 32.97,45.25 33.44,45.72 R8.1
ACCEL-EN
  Bottom 0.203: MMA8652FC.4 30.39,35.78 R138.1
ADD-0  (via drill 0.33)
  Top 0.152: v83.44,31.72 82.63,31.72 82.58,31.77 81.92,31.77 81.72,31.57 80.72,31.57 79.25,30.1 79.25,29.15 79.86,28.54 AS7C31026B.5
  Bottom 0.152: LATCH-LOW.12 83.61,31.55 v83.44,31.72
ADD-1  (via drill 0.33)
  Top 0.152: v82.87,32.38 82.58,32.1 81.63,32.1 81.49,31.96 80.53,31.96 78.77,30.19 78.77,28.86 79.06,28.57 AS7C31026B.4
  Bottom 0.152: LATCH-LOW.13 84.26,31.76 83.63,32.38 v82.87,32.38
ADD-2  (via drill 0.33)
  Top 0.152: 78.2,27.88 AS7C31026B.3 78.26,30.25 80.34,32.34 81.34,32.34 81.44,32.43 81.72,32.43 v82.11,32.81
  Bottom 0.152: LATCH-LOW.14 84.91,31.68 83.58,33 82.3,33 v82.11,32.81
ADD-3  (via drill 0.33)
  Top 0.152: 77.44,27.91 AS7C31026B.2 77.46,30.02 80.25,32.81 81.01,32.81 v81.2,33
  Bottom 0.152: LATCH-LOW.15 85.56,31.6 83.72,33.43 81.63,33.43 v81.2,33
ADD-4  (via drill 0.33)
  Top 0.152: 76.68,27.91 AS7C31026B.1 76.66,29.7 v80.44,33.48
  Bottom 0.152: LATCH-LOW.16 86.2,31.53 83.92,33.81 80.77,33.81 v80.44,33.48
ADD-5  (via drill 0.33)
  Top 0.152: AS7C31026B.44 v76.66,35.69
  Bottom 0.152: LATCH-LOW.17 86.86,31.44 83.92,34.38 77.58,34.38 76.66,35.31 v76.66,35.69
ADD-6  (via drill 0.33)
  Top 0.152: AS7C31026B.43 v77.46,35.36
  Bottom 0.152: LATCH-LOW.18 87.51,31.36 84.15,34.72 78.06,34.72 77.46,35.32 v77.46,35.36
ADD-7  (via drill 0.33)
  Top 0.152: AS7C31026B.42 v78.26,35.73
  Bottom 0.152: LATCH-LOW.19 88.16,31.29 84.39,35.05 78.68,35.05 78.26,35.47 v78.26,35.73
ADD-8  (via drill 0.33)
  Top 0.152: AS7C31026B.27 90.26,38.43 arc45 90.46,37.93 90.54,37.85 arc-45 90.77,37.3 v90.77,34.34
  Bottom 0.152: v90.77,34.34 90.75,34.36 LATCH-HIGH.12
ADD-9  (via drill 0.33)
  Top 0.152: v90.01,34.77 v90.01,37.53 | AS7C31026B.26 91.06,38.1 v91.25,37.91
  Bottom 0.152: v90.01,37.53 90.87,37.53 v91.25,37.91 | v90.01,34.77 90.1,34.85 LATCH-HIGH.13
ADD-10  (via drill 0.33)
  Top 0.152: AS7C31026B.25 91.86,37.3 v92.3,36.86
  Bottom 0.152: LATCH-HIGH.14 89.44,36.39 89.63,36.58 92.01,36.58 v92.3,36.86
ADD-11  (via drill 0.33)
  Top 0.152: AS7C31026B.24 92.66,37.98 v92.49,37.81
  Bottom 0.152: LATCH-HIGH.15 88.8,36.41 89.3,36.91 90.53,36.91 90.77,37.15 91.63,37.15 92.3,37.81 v92.49,37.81
ADD-12  (via drill 0.33)
  Top 0.152: AS7C31026B.21 v92.66,28.96
  Bottom 0.152: v92.66,28.96 92.66,30.59 88.15,35.1 LATCH-HIGH.16
ADD-13  (via drill 0.33)
  Top 0.152: AS7C31026B.20 v91.86,29.34
  Bottom 0.152: v91.86,29.34 91.86,30.82 87.5,35.18 LATCH-HIGH.17
ADD-14  (via drill 0.33)
  Top 0.152: AS7C31026B.19 v91.06,28.96
  Bottom 0.152: v91.06,28.96 91.06,31.05 86.85,35.26 LATCH-HIGH.18
ADD-15  (via drill 0.33)
  Top 0.152: AS7C31026B.18 v90.26,29.34
  Bottom 0.152: v90.26,29.34 90.26,31.28 86.2,35.34 LATCH-HIGH.19
AN0-VOLT  (via drill 0.38)
  Top 0.203: v59.72,17.81 59.72,18.19 60.58,19.05 61.63,19.05 63.06,20.48 v63.91,20.48 | v57.05,16.14 57.05,15.62 54.01,12.57 v54.01,7.14
  Bottom 0.152: 36.53,4.95 36.62,5.05 37.2,5.05 37.29,4.95 | 64.2,21.57 64.2,21.6 PIC32MX.25
  Bottom 0.203: v59.72,17.81 59.44,17.81 57.72,16.14 v57.05,16.14 | v54.01,7.14 54.01,6.76 51.72,4.48 37.91,4.48 37.43,4.95 37.29,4.95 | 36.53,4.95 36.29,4.95 34.3,2.96 28.1,2.95 28,2.86 F0.1 | 64.2,21.57 64.2,20.77 v63.91,20.48
AN1-BOOST  (via drill 0.38)
  Top 0.203: v66.44,19.14 66.3,18.96 F1.1
  Bottom 0.152: 66.44,19.89 66.44,19.92 PIC32MX.24
  Bottom 0.203: 66.44,19.89 v66.44,19.14
AN2-OIL-PESS  (via drill 0.33)
  Top 0.203: v67.82,18.76 67.82,18.14 69.34,16.62 71.25,16.62 71.68,17.05 77.15,17.05 77.87,16.34 78.51,16.34 F2.1
  Bottom 0.152: 67.82,19.08 67.82,19.11 PIC32MX.23
  Bottom 0.203: 67.82,19.08 v67.82,18.76
AN3-EGT  (via drill 0.38)
  Top 0.254: v68.77,18.19 68.77,19.24 70.58,21.05 F3.2
  Bottom 0.152: v68.77,18.19 68.77,18.72 PIC32MX.22
AN4
  Top 0.203: 37.89,5.92 38.2,5.62 38.58,5.24 39.39,5.24 40.15,6 40.15,10.34 39.24,11.24 F4.2
  Top 0.254: 4&5.2 37.89,5.92
AN5
  Top 0.203: 4&5.3 37.86,6.57 38.1,6.81 38.1,8.38 38.1,10.48 37.53,11.05 F5.1
AN6  (via drill 0.38)
  Top 0.254: 6&7.2 29.35,7.98 v29.34,8
  Bottom 0.254: F6.1 28.86,8.48 v29.34,8
AN7  (via drill 0.38)
  Top 0.254: 6&7.3 30,7.62 v30.39,8
  Bottom 0.254: v30.39,8 30.96,8.57 F7.2
AN8  (via drill 0.38)
  Top 0.254: 8&9.2 29.35,13.32 v29.34,13.34
  Bottom 0.254: v29.34,13.34 28.86,13.81 F8.1
AN9  (via drill 0.38)
  Top 0.254: 8&9.3 30,12.95 v30.39,13.34
  Bottom 0.254: v30.39,13.34 30.96,13.91 F9.2
AN10  (via drill 0.38)
  Top 0.254: 10&11.2 29.35,18.65 v29.34,18.67
  Bottom 0.254: v29.34,18.67 28.86,19.14 F10.1
AN11  (via drill 0.38)
  Top 0.254: 10&11.3 30,18.29 v30.39,18.67
  Bottom 0.254: v30.39,18.67 30.96,19.24 F11.2
AN12  (via drill 0.38)
  Top 0.254: 12&13.2 29.35,23.99 v29.34,24
  Bottom 0.254: v29.34,24 28.86,24.48 F12.1
AN13  (via drill 0.38)
  Top 0.254: 12&13.3 30,23.62 v30.39,24
  Bottom 0.254: v30.39,24 30.96,24.57 F13.2
AUTO-DETECT  (via drill 0.38)
  Top 0.254: v47.91,17.05 47.34,16.48 47.34,16.1 v46.72,15.48 | v43.43,15.81 43.05,15.43 43.05,13.72 v42.1,12.76
  Bottom 0.254: R21.2 51.96,16.57 48.39,16.57 v47.91,17.05 | v46.72,15.48 46.1,16.1 43.76,16.1 | 43.76,16.1 43.72,16.1 v43.43,15.81 | v42.1,12.76 42.1,11.27 3.3V-TOGGLE-1.1 | 5V-TOGGLE-1.1 43.76,16.1
AUX-OUT
  Top 0.203: 81.65,13.09 80.87,13.87 80.87,13.97 F2.2
  Top 0.254: 81.65,13.09 R130.2 83.12,11.62 R131.1
BARO-INT2  (via drill 0.38)
  Top 0.203: R139.1 25.72,36.1 v25.24,36.58
  Bottom 0.203: MPL3115A101.5 25.81,37.15 v25.24,36.58
BOOST-OUT
  Top 0.203: F1.2 71.44,16.19 71.91,16.67 76.91,16.67 78.68,14.91
  Top 0.254: NBPLANN100PAUNV.6 85.18,4.41 84.2,5.38 84.2,9.38 78.68,14.91
BOOST-PWR  (via drill 0.33)
  Top 0.254: v82.68,15.34 v84.72,15.34 85.06,15 85.06,13.72 84.39,13.05 84.39,10.48 85.18,9.69 NBPLANN100PAUNV.1
  Bottom 0.203: 3.3V-TOGGLE-2.3 80.35,18.52 81.06,17.81 81.92,17.81 | 87.31,17.78 5V-TOGGLE-2.3
  Bottom 0.254: 81.92,17.81 82.68,17.05 v82.68,15.34 | v84.72,15.34 84.87,15.34 87.31,17.78
CAN-BUS1  (via drill 0.33)
  Top 0.203: CAN-BUS.2 85.76,18.25 arc-45 85.41,17.41 85.08,17.07 arc-45 83.42,16.38 81.75,16.38 arc-45 79.92,17.14 79.79,17.27 arc45 78.39,17.85 76.61,17.85 arc-45 75.69,18.23 75.06,18.85 arc-45 74.68,19.79 v74.68,20
  Bottom 0.152: 74.68,20.71 74.68,20.73 PIC32MX.8
  Bottom 0.203: v74.68,20 74.68,20.71
CAN-BUS2  (via drill 0.38)
  Top 0.254: v76.39,19.14 76.72,18.82 arc45 77.08,18.67 77.15,18.67 arc90 77.34,18.86 77.34,19.14 arc-90 77.53,19.34 77.82,19.34 arc-90 78.01,19.14 78.01,18.86 arc90 78.2,18.67 78.39,18.67 arc90 78.58,18.86 78.58,19.14 arc-90 78.77,19.34 79.03,19.34 arc-45 79.41,19.18 80.04,18.55 arc90 82.54,18.55 CAN-BUS.3
  Bottom 0.152: v76.39,19.14 76.39,19.65 76.32,19.65 PIC32MX.7
CARD-DETECT  (via drill 0.38)
  Top 0.203: v32.96,39.15 32.97,39.14 SC18IS602B.1
  Bottom 0.203: MICRO-SD.G3 34.41,46.45 32.29,48.58 30.57,48.58 29.91,47.91 29.91,44.01 31.97,41.95 arc-45 32.96,39.56 v32.96,39.15
CE
  Top 0.254: AS7C31026B.6 80.66,26.75 R142.1
CHARG-CAPS
  Bottom 0.305: Y2.1 13.61,48.11 14.48,47.24 C2.1.2
CP-PUMP  (via drill 0.5)
  Top 0.61: D3.P$2 28.96,47.53 v29.15,47.72
  Bottom 0.61: C2.1.1 25.05,47.24 25.36,47.55 D2.P$1 28.98,47.55 v29.15,47.72
CPS-INPUT  (via drill 0.38)
  Top 0.254: v57.24,41.53 57.77,41.01 59.05,41.01 59.42,41.37 IMP..2
  Bottom 0.152: PIC32MX.68 57.82,37.59 57.82,37.62 57.63,37.81
  Bottom 0.203: 57.63,37.81 56.77,38.67 56.77,41.05 v57.24,41.53
DISP1-B1  (via drill 0.38)
  Top 0.203: v74.39,15.43 74.68,15.14 74.68,13.62 74.94,13.36 DISP-1.5
  Bottom 0.152: 72.87,20.82 72.87,20.85 PIC32MX.11
  Bottom 0.203: 72.87,20.82 72.87,18.76 74.39,17.24 v74.39,15.43
DISP1-B2  (via drill 0.38)
  Top 0.203: v72.39,15.43 72.39,15.24 73.14,14.49 DISP-1.11
  Bottom 0.152: 71.91,16.48 71.91,17.72 70.87,18.76 70.87,18.89 PIC32MX.18
  Bottom 0.203: 71.91,16.48 72.39,16 v72.39,15.43
DISP1-B3  (via drill 0.38)
  Top 0.203: v71.15,14.77 71.34,14.57 DISP-1.17
  Bottom 0.152: 70.53,18.63 70.53,18.66 PIC32MX.19
  Bottom 0.203: v71.15,14.77 71.53,15.14 71.53,17.53 70.53,18.53 70.53,18.63
DISP2-B1  (via drill 0.33, 0.38)
  Top 0.203: v49.82,24.67 50.2,24.67 59.01,15.86 v59.01,14.81 | v61.01,14.81 61.98,13.84 DISP-2.5
  Bottom 0.152: 52.86,31.53 53.44,31.53 53.72,31.24 54.29,31.24 54.58,31.53 54.58,31.78 PIC32MX.52
  Bottom 0.203: 52.86,31.53 52.47,31.14 arc45 50.01,25.18 50.01,24.86 v49.82,24.67 | v59.01,14.81 59.15,14.95 60.87,14.95 v61.01,14.81
DISP2-B2  (via drill 0.38)
  Top 0.203: v60.67,21.91 60.67,22.19 53.15,29.72 v52.96,29.72 | v57.63,33.05 58.48,33.91 58.48,35.24 58.86,35.62 v59.05,35.62 | v61.44,17.91 61.44,16.19 v62.29,15.34 | v59.77,14.29 60.18,13.87 DISP-2.11
  Bottom 0.152: PIC32MX.73 60.53,37.71 | 61.82,18.29 61.82,20.77 v60.67,21.91
  Bottom 0.203: 60.53,37.71 60.53,37.29 59.05,35.81 v59.05,35.62 | v52.96,29.72 53.63,30.39 54.67,30.39 57.34,33.05 v57.63,33.05 | 61.82,18.29 v61.44,17.91 | v62.29,15.34 62.29,15.05 61.34,14.1 59.96,14.1 v59.77,14.29
DISP2-B3  (via drill 0.38)
  Top 0.203: v61.34,22.57 60.87,22.57 53.82,29.62 53.82,29.81 v52.96,30.67 | v62.87,17.81 62.87,16.95 63.72,16.1 v63.72,15.05 | v57.86,14.14 57.86,13.58 arc45 58.1,13 58.24,12.87 arc-45 58.38,12.52 DISP-2.17
  Bottom 0.152: PIC32MX.74 60.91,37.89 | 62.2,18.48 62.2,20.8 arc45 61.82,21.71 61.34,22.19 v61.34,22.57
  Bottom 0.203: 60.91,37.89 60.91,37.1 59.82,36.01 59.82,34.38 59.15,33.72 57.34,33.72 54.48,30.86 53.15,30.86 v52.96,30.67 | 62.2,18.48 v62.87,17.81 | v63.72,15.05 62.29,13.62 59.44,13.62 58.91,14.14 v57.86,14.14
DISP2-RS  (via drill 0.33, 0.38)
  Top 0.203: v67.39,31.48 68.1,32.19 69.63,32.19 71.63,30.19 71.63,28.29 77.25,22.67 v77.25,20.95 | v68.1,11.72 67.51,11.12 v67.51,9.81 | DISP-2.16 59.68,7.57 61.53,5.71 65.77,5.71 v67.1,7.05
  Bottom 0.152: PIC32MX.95 67.63,32.62
  Bottom 0.203: 67.63,32.62 67.63,31.72 v67.39,31.48 | v77.25,20.95 77.92,20.29 77.92,14.67 76.39,13.14 69.53,13.14 v68.1,11.72 | v67.51,9.81 67.51,8.64 67.1,8.24 v67.1,7.05
DISP3-B1  (via drill 0.38)
  Top 0.203: v51.15,22.57 51.15,20.67 49.24,18.76 49.24,12.95 49.03,12.74 DISP-3.5
  Bottom 0.152: 52.1,27.27 PIC32MX.49
  Bottom 0.203: 52.1,27.27 51.99,27.14 arc41 51.34,25.39 51.34,22.77 v51.15,22.57
DISP3-B2  (via drill 0.38)
  Top 0.203: v58.48,19.62 58.96,20.1 59.39,20.1 60.53,21.24 61.25,21.24 68.1,28.1 v68.1,30.77 | v54.39,16.86 53.44,15.91 53.44,15.24 v52.39,14.19 | v47.05,14.19 47.23,14.02 DISP-3.11
  Bottom 0.152: v68.1,30.77 68.06,30.81 68.06,32.48 PIC32MX.96
  Bottom 0.203: v58.48,19.62 58.01,19.62 55.63,17.24 54.67,17.24 v54.39,16.86 | v52.39,14.19 52.44,14.24 47.1,14.24 v47.05,14.19
DISP3-B3  (via drill 0.38)
  Top 0.203: v53.29,11.91 53.58,12.19 53.58,12.72 56.05,15.19 v56.05,16.19 | v59.44,19.43 59.44,19.57 60.72,20.86 61.44,20.86 68.77,28.19 68.77,31.43 v68.72,31.48 | DISP-3.17 45.43,10.72 v45.62,10.53
  Bottom 0.152: 68.48,31.72 68.48,32.34 PIC32MX.97
  Bottom 0.203: v56.05,16.19 56.1,16.19 59.34,19.43 v59.44,19.43 | v68.72,31.48 68.48,31.72 | v45.62,10.53 46.81,11.72 53.1,11.72 v53.29,11.91
DISP3-RS  (via drill 0.33, 0.38)
  Top 0.203: v78.87,24.19 79.96,23.1 v79.96,21.72 | v78.77,13.14 79.2,12.72 79.2,7.24 78.34,6.38 74.72,6.38 arc-45 72.42,7.34 DISP-1.16
  Bottom 0.152: PIC32MX.1 70.32,29.05
  Bottom 0.203: v78.87,24.19 77.44,24.19 72.96,28.57 72.39,28.57 71.91,29.05 70.32,29.05 | v79.96,21.72 79.96,21.1 79.25,20.38 79.25,14.1 78.77,13.62 v78.77,13.14
DISP-1_HPD  (via drill 0.38)
  Top 0.203: v76.49,15.62 77.53,14.57 77.53,11.11 76,9.57 75.77,9.38 75.39,9 75.39,8.28 DISP-1.6
  Bottom 0.152: 73.82,21 73.82,21.03 PIC32MX.9
  Bottom 0.203: 73.82,21 73.82,19.34 76.01,17.14 76.01,16.1 v76.49,15.62
DISP-HPD2  (via drill 0.33)
  Top 0.203: v64.48,12.1 64.1,11.72 64.1,10.76 62.44,9.1 62.44,8.28 DISP-2.6
  Bottom 0.152: 77.53,18.98 77.53,19.01 PIC32MX.6
  Bottom 0.203: 77.53,18.98 77.53,14.86 76.3,13.62 69.15,13.62 67.9,12.37 arc-45 67.7,12.29 64.67,12.29 v64.48,12.1
DISP-HPD3  (via drill 0.38)
  Top 0.203: v49.05,23.53 49.05,20.48 48.1,19.53 v48.1,18.38 | v50.96,17.81 51.1,17.67 51.1,10.72 49.48,9.1 49.48,8.28 DISP-3.6
  Bottom 0.152: PIC32MX.51 52.87,32.11
  Bottom 0.203: 52.87,32.11 50.8,30.04 arc45 49.62,27.2 49.62,26.13 arc-45 49.4,25.59 49.28,25.46 arc45 49.05,24.93 v49.05,23.53 | v50.96,17.81 49.34,17.81 48.77,18.38 v48.1,18.38
EGT-NEG-IN  (via drill 0.38)
  Top 0.305: R136.2 91.82,21.43 92.45,22.06 EGT-AMP.4 | v90.39,21.29 91.01,20.67 R136.2 | R136.2 91.83,16.47 92.77,15.53 92.77,14.29 91.64,13.16 EGT.R
  Bottom 0.305: v90.39,21.29 90.58,21.47 R133.1
EGT-OUT  (via drill 0.38)
  Top 0.203: v87.49,22.24 82.3,22.24 arc45 80.83,21.63 80.69,21.49 arc-45 77.78,20.29 76.01,20.29 74.14,22.16 arc45 71.08,23.42 F3.1
  Top 0.254: EGT-AMP.1 88.96,24.57 87.49,23.1 v87.49,22.24
  Bottom 0.254: R133.2 87.72,22.48 v87.49,22.24
EGT-POS-IN
  Top 0.305: EGT-AMP.3 89.68,22.3 89.68,18.34 89.14,17.8 EGT.L
EGT-SHTDWN  (via drill 0.38)
  Top 0.305: v94.44,23.72 94.34,23.62 EGT-AMP.5
  Bottom 0.305: R132.1 94.26,23.9 v94.44,23.72
FD-B1
  pour Bottom: 4.2,42.75 arc90 4.7,43.25 arc90 4.2,43.75 arc90 3.7,43.25 arc90
FD-B2
  pour Bottom: 92.7,42.75 arc90 93.2,43.25 arc90 92.7,43.75 arc90 92.2,43.25 arc90
FD-B3
  pour Bottom: 92.7,1.35 arc90 93.2,1.85 arc90 92.7,2.35 arc90 92.2,1.85 arc90
FD-F1
  pour Top: 4.2,42.75 arc90 4.7,43.25 arc90 4.2,43.75 arc90 3.7,43.25 arc90
FD-F2
  pour Top: 92.7,42.75 arc90 93.2,43.25 arc90 92.7,43.75 arc90 92.2,43.25 arc90
FD-F3
  pour Top: 92.7,1.35 arc90 93.2,1.85 arc90 92.7,2.35 arc90 92.2,1.85 arc90
GND  (via drill 0.33, 0.38, 0.5, 1, 1.6)
  Top 0.203: 17.6,23.24 MAIN-SMPS.1 | 57.77,11.72 57.77,12.76 57.63,12.91 | DISP-2.13 59.58,10.44 59.53,10.38 | DISP-2.7 61.38,10.44 61.44,10.38 | MAIN-SMPS.3 16.6,23.88 16.78,24.07 | MAIN-SMPS.12 16.6,18.74 16.76,18.57
  Top 0.254: C6.2 19.44,23.91 18.27,23.91 17.6,23.24 | 58.77,46.2 58.77,47.53 | 30,20.1 30,21.43 | 30,14.76 30,16.1 | 30,9.43 30,10.76 | 39.05,7.91 39.05,6.91 | 48.39,28.29 47.34,28.29 | 30,5.43 30,4.1 | 45.58,30.89 45.58,30.24 45.73,30.09 JTAG.5 | 46.39,30.19 46.15,30.19 45.72,29.77
  Bottom 0.254: 58.77,46.2 58.77,47.53 | 30,20.38 30,21.43 | 30,15.05 30,16.1 | 30,9.43 30,10.48 | 39.72,6.57 38.39,6.57 | 48.39,28.29 47.05,28.29 | 30,5.19 30,4.38 | DISP-3.14 46.05,9.24 | 5V-TOGGLE-2.2 84.71,12.92
  other vias: 61.82,39.15 59.05,20.76 14.67,20.95 14.67,21.91 15.62,21.91 15.62,20.95 16.57,20.95 17.53,20.95 17.53,21.91 16.57,21.91 87.44,29 92.68,33.43 60.58,17.24 60.29,32.29 63.34,29.24 53.48,38.96 47.62,40.2 40.01,18.1 38.96,37.62 37.29,41.81 59.15,34.67 70.77,42.29 78.34,12.1 44.91,14.48 53.58,14 65.01,19.43 74.82,29.38 70.48,29.81 85.25,24.19 47.53,5.14 60.48,5.14 73.44,5.14 23.34,18.86 23.34,25.34 19.67,39.05 21.57,39.05 22.62,38.29 22.62,37.15 21.57,36.29 19.67,36.29 18.62,37.15 18.62,38.29 1.81,18.48 72.25,14.38 20.62,37.72 26.86,38.2
  pour Top (isolate 0.203, no thermals): 10.95,21.53 11.62,21.53 12.29,22.19 15.14,22.19 15.14,20.67 10.95,20.67
  pour Top (isolate 0.203, rank 3): 16.48,14.76 25.43,14.76 25.43,27.87 24.06,29.24 18.38,29.24 16.48,27.34 16.53,22.76 16.67,22.76 16.67,23.72 18.51,25.6 18.51,25.94 18.86,26.29 20.19,26.29 20.57,25.91 20.57,23.43 20,22.86 17.53,22.86 17.53,20.1 16.53,20.1
  pour Bottom (isolate 0.203, rank 3): 4.86,8.67 4.86,28.29 6.19,29.62 23.98,29.62 25.43,28.17 25.43,5.63 24.08,4.29 9.24,4.29
  pour Bottom (isolate 0.178, rank 6): 92.2,1.02 7.62,1.02 1.02,7.62 1.02,42.29 7.62,48.9 92.2,48.9 98.81,42.29 98.81,7.62
  pour Top (isolate 0.178, rank 6): 92.2,1.02 7.62,1.02 1.02,7.62 1.02,13.34 3.71,13.34 3.71,8.34 7.58,4.48 24.57,4.48 24.57,27.81 16.95,27.81 16.95,29.15 15.34,30.77 5.62,30.77 3.71,28.86 3.71,13.43 1.02,13.43 1.02,42.29 7.62,48.9 92.2,48.9 98.81,42.29 98.81,7.62
  pour Top (isolate 0.203, no thermals): 18.1,20.62 14.1,20.62 14.1,22.24 17.53,22.24 17.53,23.05 18.1,22.67
HB
  Top 0.203: AS7C31026B.40 79.86,42.45 R146.1
I2C-INT-BUS-PIN1  (via drill 0.33, 0.38)
  Top 0.203: v66.75,37.16 66.96,36.96 v66.96,33.24 | v65.63,40.86 67.91,38.58 v67.91,38.48 | v27.67,36.15 29.34,37.81 31.34,37.81 31.91,38.39 31.91,39.05 32.67,39.81 35.43,39.81 36.34,40.72 37.86,40.72 v39.34,42.2
  Bottom 0.152: PIC32MX.91 66.77,34.02 66.77,33.43 v66.96,33.24
  Bottom 0.203: v65.63,40.86 64.29,42.2 60.01,42.2 59.72,42.48 39.62,42.48 v39.34,42.2 | MPL3115A101.6 27.47,36.34 v27.67,36.15 | v67.91,38.48 67.91,38.32 v66.75,37.16
I2C-PIN1  (via drill 0.38)
  Top 0.203: R140.2 32.29,33.81 v32.67,33.43
  Bottom 0.152: PIC32MX.66 57.24,37.03 56.01,38.27 56.01,40.77 | 40.39,41.53 40.21,41.53 arc45 40.02,41.45
  Bottom 0.203: 33.05,34.58 33.34,34.58 34,35.24 34,35.43 40.02,41.45 | 33.05,34.58 32.66,34.58 arc-45 32.35,34.7 32.21,34.84 arc-45 32.1,35.12 32.1,35.37 arc45 31.99,35.64 30.68,36.95 arc45 30.2,37.15 MPL3115A101.8 | 33.05,34.58 32.67,34.2 v32.67,33.43 32.39,33.71 MMA8652FC.5 | 56.01,40.77 55.24,41.53 40.39,41.53
I2C-PIN2  (via drill 0.38)
  Top 0.203: v33.34,35.53 30.39,35.53 29.81,36.1 | R141.1 29.81,36.1 | 29.81,36.1 29.41,36.1 v29.32,36.02
  Bottom 0.152: PIC32MX.67 57.53,37.31 56.39,38.46 56.39,40.95 | 40.44,41.91 arc45 39.53,41.54 | 34.23,36.8 34.23,36.88
  Bottom 0.203: MPL3115A101.7 28.72,36.62 v29.32,36.02 28.8,35.5 MMA8652FC.3 | 56.39,40.95 55.43,41.91 40.44,41.91 | 39.53,41.54 38.9,40.91 arc-56 38.57,40.81 38.28,40.9 arc113 38.06,40.68 38.13,40.32 arc-113 37.88,40.07 37.52,40.14 arc113 37.3,39.91 37.38,39.52 arc-113 37.15,39.3 36.76,39.38 arc113 36.54,39.15 36.62,38.76 arc-113 36.39,38.54 36,38.62 arc113 35.77,38.39 35.85,38 arc-113 35.63,37.77 35.24,37.85 arc113 35.01,37.63 35.09,37.24 arc-113 34.87,37.01 34.45,37.1 arc108 34.23,36.88 | v33.34,35.53 33.96,36.15 arc45 34.23,36.8
I2C-SD-PIN1  (via drill 0.38)
  Top 0.203: v39.62,38.77 39.43,38.96 37.81,38.96 37.52,38.66 SC18IS602B.8
  Bottom 0.152: PIC32MX.58 54.61,35.15
  Bottom 0.203: 54.61,35.15 49.59,35.15 arc-45 49.32,35.26 49.15,35.43 arc-45 49.05,35.67 49.05,36.1 arc90 48.86,36.29 48.48,36.29 arc-90 48.29,36.48 48.29,36.86 arc90 48.1,37.05 47.72,37.05 arc-90 47.53,37.24 47.53,37.62 arc90 47.34,37.81 46.96,37.81 arc-90 46.77,38.01 46.77,38.48 arc90 46.58,38.67 42.53,38.67 42.48,38.72 41.91,38.72 41.86,38.67 39.72,38.67 v39.62,38.77
I2C-SD-PIN2  (via drill 0.38)
  Top 0.203: v40.29,39.43 40.1,39.62 37.81,39.62 36.87,38.68 SC18IS602B.7
  Bottom 0.152: PIC32MX.59 54.79,35.53 | 42.58,39.15 42.53,39.1 41.86,39.1 41.82,39.14
  Bottom 0.203: 54.79,35.53 51.48,35.53 arc-45 50.27,36.03 47.61,38.69 arc45 46.52,39.14 42.58,39.15 | 41.82,39.14 40.58,39.14 v40.29,39.43
ICSP-CLK
  Top 0.406: ICSP.1 37.78,34.96 40.58,32.16 JP1.3
ICSP-DATA
  Bottom 0.406: ICSP.2 38.2,32.42 40.86,35.08 JP2.3
ICSP-MCLR  (via drill 0.33, 0.38)
  Top 0.203: v70.77,17.34 71.34,17.91 C7.2 71.9,18.84 72.4,19.34 F14.2 | R12.2 38.96,24.8
  Top 0.406: ICSP.5 38.96,24.8 39.66,24.8 v40.39,25.53
  Bottom 0.203: v70.77,17.34 68.87,15.44 68.87,14.01 67.63,12.76
  Bottom 0.254: 67.63,12.76 58.01,12.76 57.67,13.1 45.05,13.1 41.81,16.29 41.81,24.05 v40.39,25.53
INPUT-6_/_ICSP-CLK  (via drill 0.38)
  Top 0.203: v49.62,32.48 52.47,32.48 arc-45 53.14,32.2 54.4,30.94 arc-45 54.58,30.52 54.58,30.34 arc45 54.81,29.77 59.2,25.39 arc45 60.01,25.05 v60.67,25.05
  Bottom 0.152: PIC32MX.26 61.49,23.65 arc90 61.49,24.61 61.05,25.05
  Bottom 0.203: 61.05,25.05 v60.67,25.05
  Bottom 0.406: JP1.2 45.17,29.62 arc45 47.9,30.75 v49.62,32.48
INPUT-7_/_ICSP-DATA  (via drill 0.33, 0.38)
  Top 0.203: v61.05,24.1 60.87,24.29 59.72,24.29 54.2,29.81 54.2,30.37 arc45 54.05,30.72 53.24,31.53 49.62,31.53 v48.58,32.58
  Bottom 0.152: PIC32MX.27 61.05,23.78
  Bottom 0.203: 61.05,23.78 v61.05,24.1
  Bottom 0.305: 46.05,35.15 46.48,34.72
  Bottom 0.406: 46.05,35.15 43.53,37.62 JP2.2 | 46.48,34.72 48.58,32.62 v48.58,32.58
JTAG-PIN-1  (via drill 0.38)
  Top 0.203: JTAG.1 46.52,26.99 arc-45 47.05,26.77 47.19,26.62 arc90 48.34,26.62 48.55,26.83 arc-45 48.85,26.96 49.21,26.96 arc-45 51.22,26.13 57.74,19.7 arc-45 57.82,19.51 57.82,19.36 arc45 57.91,19.15 58,19.06 arc45 58.94,18.67 59.63,18.67 60.48,19.53 61.44,19.53 63.25,21.34 v63.53,21.34
  Bottom 0.152: 63.53,21.48 62.44,22.57 arc-39 62.27,22.93 62.27,23 arc-51 62.38,23.33 62.63,23.58 64.46,25.41 arc-90 64.91,25.41 PIC32MX.17
  Bottom 0.203: 63.53,21.48 v63.53,21.34
JTAG-PIN-2  (via drill 0.38)
  Top 0.152: 47,27.39 47.23,27.16 arc90 48.21,27.16 arc-45 48.87,27.43
  Top 0.203: JTAG.2 46.4,27.64 arc-45 47,27.39 | 48.87,27.43 49.03,27.43 arc90 49.24,27.64 49.24,28 arc-90 49.44,28.19 49.82,28.19 arc-90 50.01,28 50.01,27.62 arc90 50.2,27.43 50.37,27.43 arc-45 50.88,27.22 51.11,27 arc90 51.38,27 51.76,27.38 arc-90 52.06,27.38 52.24,27.2 arc-90 52.24,26.9 51.87,26.54 arc90 51.87,26.23 51.95,26.15 arc90 52.25,26.15 52.52,26.42 arc-90 52.82,26.42 52.9,26.34 arc-90 52.81,25.95 52.73,25.86 arc90 52.73,25.38 53.86,24.25 arc45 53.99,24.19 54.2,24.19 arc90 54.39,24.38 54.39,24.57 arc-90 54.58,24.77 54.77,24.77 arc-90 54.96,24.57 54.96,24.38 arc90 55.15,24.19 v55.34,24.19
  Bottom 0.152: PIC32MX.38 56.39,25.34 56.1,25.05 56.01,25.05 55.67,24.72 55.67,24.62 55.34,24.29
  Bottom 0.203: 55.34,24.29 v55.34,24.19
JTAG-PIN-3  (via drill 0.38)
  Top 0.203: JTAG.3 46.62,28.29 46.77,28.44 46.77,29.77 47.22,30.22 arc90 47.22,30.84 46.59,31.47 arc-45 46.34,32.07 46.34,32.27 arc-90 46.55,32.48 47.24,32.48 arc90 47.53,32.77 47.53,33.37 arc-45 47.65,33.64 48.53,34.53 arc-45 48.87,34.67 49.53,34.67 arc90 49.82,34.96 49.82,35.6 arc-90 50.03,35.81 50.64,35.81 arc45 51.18,36.04 v51.34,36.2
  Bottom 0.152: PIC32MX.60 54.98,35.91
  Bottom 0.203: 54.98,35.91 51.63,35.91 v51.34,36.2
JTAG-PIN-4  (via drill 0.38)  (1 unrouted)
  Top 0.203: v50.67,36.86 50.48,36.67 50.1,36.67 46.2,32.77 44.96,32.77 44.1,31.91 44.1,29.81 | 45.81,28.96 JTAG.4
  Bottom 0.152: PIC32MX.61 55.26,36.2
  Bottom 0.203: 55.26,36.2 55.05,36.39 52.1,36.39 51.63,36.86 v50.67,36.86
LB
  Top 0.203: AS7C31026B.39 80.66,40.56 R147.1
LNS-INPUT  (via drill 0.38)
  Top 0.254: IMP..3 58.77,42.1 v58.39,41.72
  Bottom 0.152: PIC32MX.69 58.1,37.88 58.1,37.91 57.91,38.1
  Bottom 0.203: 57.91,38.1 57.15,38.86 57.15,40.48 v58.39,41.72
MCLR  (via drill 0.38)
  Top 0.203: F14.1 72.29,21.04 v71.72,20.48
  Bottom 0.152: 71.72,20.83 71.72,20.86 PIC32MX.13
  Bottom 0.254: v71.72,20.48 71.72,20.83
MPL-BYP-CAP
  Bottom 0.305: MPL3115A101.2 28.72,40.64 C127.1
N$5  (via drill 0.38)
  Top 0.254: v28.48,33.91 28.85,34.28 C121.1
  Bottom 0.203: MMA8652FC.1 27.5,34.45 27.86,34.1 28.29,34.1 v28.48,33.91
OE
  Top 0.203: AS7C31026B.41 79.06,40.49 R145.1
OE0
  Bottom 0.254: Y2.5 7.3,46.16 6.86,45.72 6.72,45.58 R13.1
OIL-PRESS-OUT  (via drill 0.38)
  Top 0.254: v86.3,11.62 86.2,11.62 R131.2
  Bottom 0.305: AUX-PRESS.P3 86.89,11.03 v86.3,11.62
OSC-PWR  (via drill 0.38)
  Top 0.203: 2.8V.5 54.24,36.11 v53.29,37.05
  Bottom 0.203: v53.29,37.05 52.77,37.05 52.23,37.59 Y1.P$4 51.29,38.03 51.24,38.08 C1.2
OSC-SIG
  Bottom 0.152: PIC32MX.64 56.76,36.39 56.58,36.39
  Bottom 0.203: 56.58,36.39 56.43,36.39
  Bottom 0.254: 56.43,36.39 Y1.P$3
PMA-CS2  (via drill 0.38)
  Top 0.203: v44.1,11.72 44.1,14.76 45.24,15.91 45.24,22.95 45.05,23.1 v45.05,23.38 | v44.2,33.53 45.81,33.53 52.48,40.2 v57.82,40.2
  Bottom 0.152: PIC32MX.70 58.39,38.16 58.39,38.2 58.2,38.39 58.2,39.81
  Bottom 0.203: DISP-3.16 45.58,8.27 45.58,8.95 44.1,10.43 v44.1,11.72 | v45.05,23.38 44.39,24.05 44.39,27.24 43.29,28.34 41.01,28.34 40.29,29.05 40.29,32.59 41.23,33.53 v44.2,33.53 | 58.2,39.81 v57.82,40.2
PMA-HL  (via drill 0.33, 0.38)
  Top 0.203: v76.15,21.67 76.06,21.67 73.83,23.89 arc90 65.14,23.89 61.44,20.19 v61.15,20.19 | v59.82,21.48 59.82,22.48 55.72,26.57 v54.39,26.57
  Bottom 0.152: PIC32MX.43 54.8,26.57
  Bottom 0.203: LATCH-HIGH.11 91.4,32.42 93.3,30.53 93.3,28.64 89.09,24.43 88.44,24.43 86.39,22.38 79.34,22.38 78.63,21.67 v76.15,21.67 | v61.15,20.19 61.1,20.19 v59.82,21.48 | v54.39,26.57 54.8,26.57
PMA-LL  (via drill 0.33, 0.38)
  Top 0.152: v82.3,31.15 81.39,31.15 v79.87,29.62
  Top 0.254: v66.77,28.38 65.62,27.23 arc-45 61.84,25.67 61.48,25.67 arc-45 58.15,27.05 57.2,28 v57.2,28.34
  Bottom 0.152: LATCH-LOW.11 82.56,31.15 v82.3,31.15 | 55.99,28.34 PIC32MX.44
  Bottom 0.203: v79.87,29.62 78.77,30.77 70.48,30.77 70.06,30.34 69.29,30.34 67.34,28.38 v66.77,28.38 | 55.99,28.34 v57.2,28.34
PMD0  (via drill 0.33)
  Top 0.152: v75.25,35.15 75.34,35.15 76.11,34.38 v76.2,34.38 | v81.46,26.98 AS7C31026B.7 v81.46,29.19
  Bottom 0.152: v75.25,35.15 74.97,35.15 arc-90 74.58,35.54 74.58,35.72 arc90 74.39,35.91 arc90 74.2,35.72 74.2,35.38 arc-90 74.01,35.2 arc-90 73.82,35.38 73.82,35.72 arc90 73.63,35.91 arc90 73.44,35.72 73.44,35.38 arc-90 73.25,35.2 arc-90 73.06,35.38 73.06,35.72 arc90 72.87,35.91 arc90 72.68,35.72 72.68,35.38 arc-90 72.48,35.2 arc-90 72.3,35.38 72.3,35.72 arc90 72.1,35.91 arc90 71.91,35.72 71.91,35.38 arc-90 71.72,35.2 arc-90 71.53,35.38 71.53,35.72 arc90 71.34,35.91 arc90 71.15,35.72 71.15,35.38 arc-90 70.96,35.2 arc-90 70.77,35.38 70.77,35.72 arc90 70.58,35.91 arc90 70.39,35.72 70.39,35.38 arc-90 70.2,35.2 arc-90 70.01,35.38 arc90 69.82,35.53 69.74,35.53 arc45 69.18,35.3 PIC32MX.93 | v76.2,34.38 76.49,34.38 81.46,29.41 v81.46,29.19 | LATCH-LOW.9 83.61,25.74 83.34,26 82.01,26 81.46,26.55 v81.46,26.98
PMD1  (via drill 0.33)
  Top 0.152: v82.26,26.63 AS7C31026B.8 v82.26,28.86
  Bottom 0.152: PIC32MX.94 69.21,34.77 69.82,34.77 arc-90 70.01,34.58 70.01,34.43 arc90 70.2,34.24 arc90 70.39,34.43 70.39,34.77 arc-90 70.58,34.96 arc-90 70.77,34.77 70.77,34.43 arc90 70.96,34.24 arc90 71.15,34.43 71.15,34.77 arc-90 71.34,34.96 arc-90 71.53,34.77 71.53,34.43 arc90 71.72,34.24 arc90 71.91,34.43 71.91,34.77 arc-90 72.1,34.96 arc-90 72.3,34.77 72.3,34.43 arc90 72.48,34.24 arc90 72.68,34.43 72.68,34.77 arc-90 72.87,34.96 arc-90 73.06,34.77 73.06,34.43 arc90 73.25,34.24 arc90 73.44,34.43 73.44,34.77 arc-90 73.63,34.96 arc-90 73.82,34.77 73.82,34.43 arc90 74.01,34.24 arc90 74.2,34.43 74.2,34.77 arc-90 74.39,34.96 74.42,34.96 arc-45 74.61,34.88 74.96,34.53 75.49,34.53 75.96,35 76.44,35 82.2,29.33 82.26,29.28 v82.26,28.86 | LATCH-LOW.8 84.26,25.75 83.68,26.34 82.44,26.34 82.26,26.52 v82.26,26.63
PMD2  (via drill 0.33)
  Top 0.152: v76.49,33.53 76.53,33.48 78.34,33.48 v78.63,33.77 | v83.15,26.96 83.06,27.05 AS7C31026B.9 v83.06,29.24